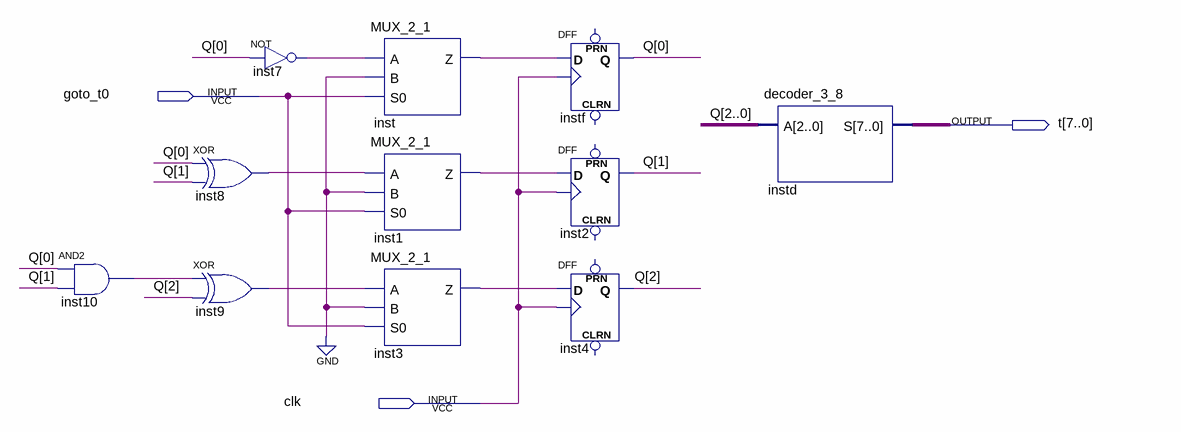
[diagram p0: schematic sheet]
// Quartus schematic timer.bdf as structural Verilog: 11 symbols, 3 pins
module timer (
  input  goto_t0,
  input  clk,
  output [7:0] t
);

  wire inst1_z, inst3_z, inst7_out, inst8_out, inst9_out, inst10_out, inst_z;
  wire [2:0] Q;

  and inst10 (inst10_out, Q[0], Q[1]);
  xor inst8 (inst8_out, Q[0], Q[1]);
  xor inst9 (inst9_out, inst10_out, Q[2]);
  not inst7 (inst7_out, Q[0]);
  MUX_2_1 inst (.A(inst7_out), .B(1'b0), .S0(goto_t0), .Z(inst_z));
  MUX_2_1 inst1 (.A(inst8_out), .B(1'b0), .S0(goto_t0), .Z(inst1_z));
  MUX_2_1 inst3 (.A(inst9_out), .B(1'b0), .S0(goto_t0), .Z(inst3_z));
  DFF instf (.CLK(clk), .D(inst_z), .Q(Q[0]));  // open: CLRN, PRN
  DFF inst2 (.CLK(clk), .D(inst1_z), .Q(Q[1]));  // open: CLRN, PRN
  DFF inst4 (.CLK(clk), .D(inst3_z), .Q(Q[2]));  // open: CLRN, PRN
  decoder_3_8 instd (.A(Q), .S(t));
endmodule
